# Altium project PCB_Project.PrjPcb
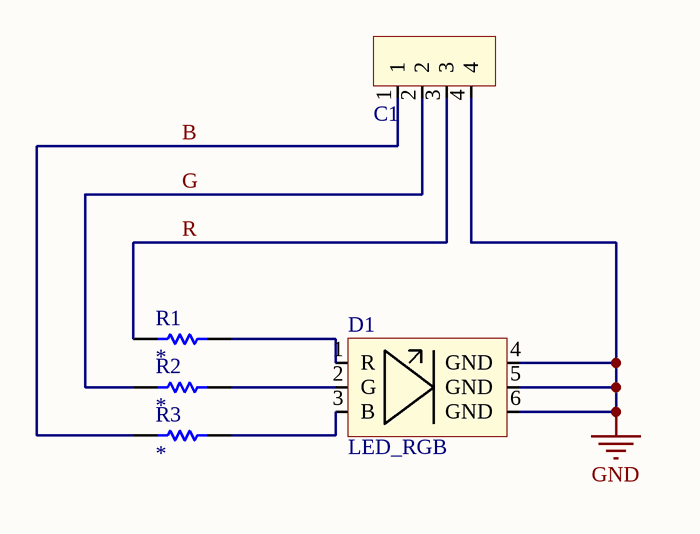
[diagram p0: ledKjoleribbeKort.SchDoc]
1 sheet, 5 parts. Net scope: global (net labels, ports and power ports of the same name join across sheets).
Board file: ledKjoleribbeKort.PcbDoc

## Sheet ledKjoleribbeKort.SchDoc
size A4

### Parts
C1  GX10-4  [GX16-4]  (value not drawn)
D1  LED_RGB  [LED_RGB_3W]
R1  RESISTOR  [EFFECT_RESISTOR_5W]  (value not drawn)
R2  RESISTOR  [EFFECT_RESISTOR_5W]  (value not drawn)
R3  RESISTOR  [EFFECT_RESISTOR_5W]  (value not drawn)

### Nets
GND: C1.4 D1.4(GND) D1.5(GND) D1.6(GND)
B: C1.1 R3.1
G: C1.2 R2.1
R: C1.3 R1.1
NetD1_1: D1.1(R) R1.2
NetD1_2: D1.2(G) R2.2
NetD1_3: D1.3(B) R3.2

### Library data of the parts
R1-R3 = RESISTOR: max effect: *; resistance: *